# Altium schematic sheet SHDN-BSPD-S06-V00-BSPDSense.SchDoc: Multiplexer
size A3; DrawnBy: Joe Richards; DocumentNumber: 6; Revision: 01; SheetNumber: 6; SheetTotal: 12
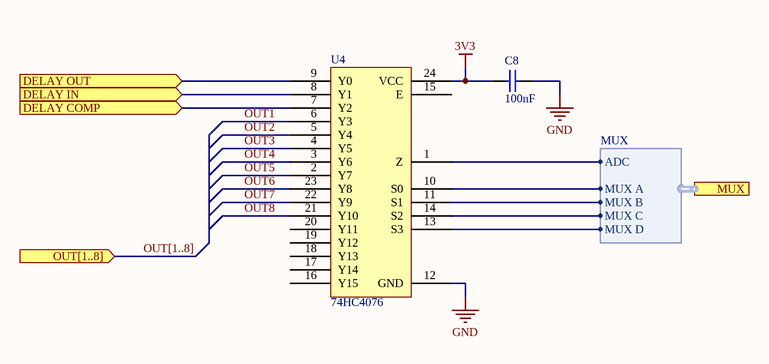
[diagram p0: SHDN-BSPD-S06-V00-BSPDSense.SchDoc]

## Parts
C8  100nF  [Cap_Ceramic_0603]
U4  74HC4076  [TSSOP-24]

## Ports
DELAY COMP (in), DELAY IN (in), DELAY OUT (in), MUX (harness MUX), OUT[1..8] (in)

## Harnesses
MUX: ADC, MUX A, MUX B, MUX C, MUX D

## Nets
3V3: C8.1 U4.24(VCC)
GND: C8.2 U4.12(GND)
DELAY COMP: U4.7(Y2) ; port DELAY COMP
DELAY IN: U4.8(Y1) ; port DELAY IN
DELAY OUT: U4.9(Y0) ; port DELAY OUT
OUT1: U4.6(Y3)
OUT2: U4.5(Y4)
OUT3: U4.4(Y5)
OUT4: U4.3(Y6)
OUT5: U4.2(Y7)
OUT6: U4.23(Y8)
OUT7: U4.22(Y9)
OUT8: U4.21(Y10)
NetU4_1: U4.1(Z) ; port MUX.ADC
NetU4_10: U4.10(S0) ; port MUX.MUX A
NetU4_11: U4.11(S1) ; port MUX.MUX B
NetU4_13: U4.13(S3) ; port MUX.MUX D
NetU4_14: U4.14(S2) ; port MUX.MUX C

Not connected (* = marked no-connect by the designer): U4 15(E) 16(Y15) 17(Y14) 18(Y13) 19(Y12) 20(Y11)

## Buses and harness runs
bus OUT[1..8] = port OUT[1..8]

## Notes on the sheet
- Revision History:
- Sheet Title:
- Rev
- Date
- Description
- Project:
- Size:
- Drawn By:
- A3
- Number:
- Revision:
- Sheet
- Version:
- of
- QUT Motorsport
- O-120, Gardens Point
- 2 George Street
- Brisbane, QLD 4000
- Australia
- Print Date:
- Print Time:
- File Name:

## Library data of the parts
C8 = 100nF 50V 5% X7R 0603: Capacitor, Ceramic, SMD, 100nF, 50V, 5%, X7R, 0603
U4 = 74HC4076: 16:1 Analog Switch (SP16T) 60Ohm, TSSOP24